# Altium schematic sheet [04] - CAN.SchDoc
size A3
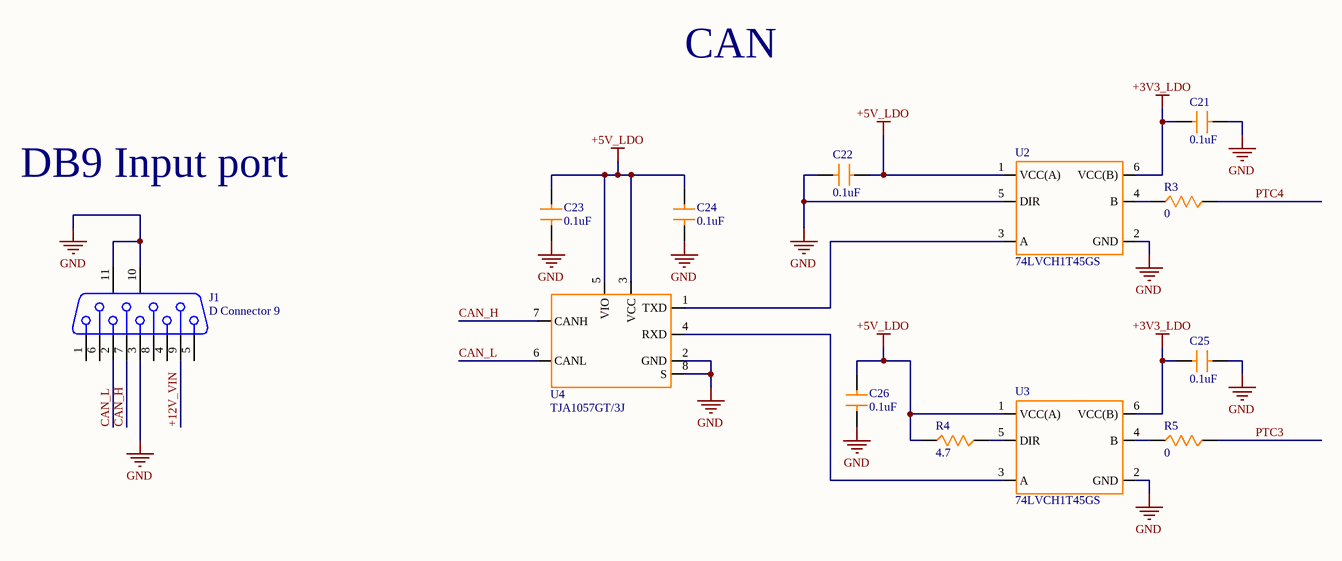
[diagram p0: [04] - CAN.SchDoc]

## Parts
C21  0.1uF  [C0805]
C22  0.1uF  [C0805]
C23  0.1uF  [C0805]
C24  0.1uF  [C0805]
C25  0.1uF  [C0805]
C26  0.1uF  [C0805]
J1  D Connector 9  [DSUB1.385-2H9]
R3  0  [R0805]
R4  4.7  [R0805]
R5  0  [R0805]
U2  74LVCH1T45GS  [74LVCH1T45GS,132]
U3  74LVCH1T45GS  [74LVCH1T45GS,132]
U4  TJA1057GT/3J  [TJA1057GT/3J]

## Nets
+3V3_LDO: C21.2 C25.2 U2.6(VCC(B)) U3.6(VCC(B))
+5V_LDO: C22.2 C23.2 C24.2 C26.2 R4.1 U2.1(VCC(A)) U3.1(VCC(A)) U4.3(VCC) U4.5(VIO)
GND: C21.1 C22.1 C23.1 C24.1 C25.1 C26.1 J1.3 J1.10(MH1) J1.11(MH2) U2.2(GND) U2.5(DIR) U3.2(GND) U4.2(GND) U4.8(S)
+12V_VIN: J1.9
CAN_H: J1.7 U4.7(CANH)
CAN_L: J1.2 U4.6(CANL)
PTC3: R5.2
PTC4: R3.2
NetR3_1: R3.1 U2.4(B)
NetR4_2: R4.2 U3.5(DIR)
NetR5_1: R5.1 U3.4(B)
NetU2_3: U2.3(A) U4.1(TXD)
NetU3_3: U3.3(A) U4.4(RXD)

Not connected (* = marked no-connect by the designer): J1 1 4 5 6 8

## Notes on the sheet
- CAN
- DB9 Input port

## Library data of the parts
C21-C26 = C_0805-0.1uF: Multilayer Ceramic Capacitors MLCC - SMD/SMT 0.1uF 10% 50V AEC-Q200; Manufacturer: Yageo; Manufacturer Part Number: AS0805KKX7R9BB104; Voltage Rating DC: 50 VDC; Capacitance - nF: 100 nF; Capacitance - pF: 100000 pF; CNHTS: 8532241000; Dielectric: X7R; TARIC: 8532240000; Product Status: New Product; Supplier 1: Mouser; RoHS: RoHS Compliant; Category: Multilayer Ceramic Capacitors MLCC - SMD/SMT; Stock 1: 30283; Pricing 1: 1=0.670, 10=0.461, 100=0.262, 500=0.238, 1000=0.165, 3000=0.156, 6000=0.146, 9000=0.136, 24000=0.122 (USD); Capacitance: 0.1 uF; Height: 1.25 mm; Length: 2 mm; Package / Case: 0805 (2012 metric); Packaging: Cut Tape; Product: Automotive MLCCs; Series: AS; Termination Style: SMD/SMT; Tolerance: 10 %; Width: 1.25 mm; Brand: Yageo; Case Code - in: 0805; Case Code - mm: 2212; HTS Code: 8532240020; Maximum Operating Temperature: + 125 C; Minimum Operating Temperature: - 55 C; Product Type: Ceramic Capacitors; Standard Pack Qty: 3000; Subcategory: Capacitors; Termination: Flexible (Soft); RoHS - Mouser: Y; Minimum Order Quantity: 1; Reeling: True; ComponentLink1URL: http://www.mouser.com/datasheet/2/447/yageodocoutput-1313910.pdf; ComponentLink1Description: http://www.mouser.com/datasheet/2/447/yageodocoutput-1313910.pdf; Supplier Part Number 1: 603-AS0805KKX79BB104
J1 = D Connector 9: Receptacle Assembly, 9 Position, Right Angle; PackageDocument: O; Positions: 9; Published: 15-Jun-2001; LatestRevisionDate: 17-Jul-2002; LatestRevisionNote: Re-released for DXP Platform.; DatasheetDocument: 1-Sep-1999; PackageReference: 788750; Publisher: Altium Limited; Orientation: Right Angle; Gender: Receptacle
R3 R5 = R_0805-0: Current Sense Resistors - SMD 0 ohm Jumper 1/2W; Manufacturer: Yageo; Manufacturer Part Number: PA0805-R-470RL; Power Rating: 500 mW (1/2 W); Resistance: 0 Ohms; CNHTS: 8533211000; TARIC: 8533210000; Product Status: New Product; Supplier 1: Mouser; RoHS: RoHS Compliant; Category: Current Sense Resistors - SMD; Stock 1: 3927; Pricing 1: 1=1.30, 10=1.06, 100=0.706, 500=0.595, 1000=0.495, 5000=0.431, 10000=0.421, 25000=0.409 (USD); Application: Current Sense; Length: 2.03 mm; Packaging: Cut Tape; Product: Current Sense Chip Resistor Surface Mount; Series: PA_L; Technology: Metal Element; Termination Style: SMD/SMT; Tolerance: -; Type: Low TCR Current Sense Resistor; Width: 1.27 mm; Brand: Yageo; Mounting Style: PCB Mount; Case Code - in: 0805; Case Code - mm: 2012; HTS Code: 8533210030; Maximum Operating Temperature: + 155 C; Minimum Operating Temperature: - 55 C; Product Type: Current Sense Resistors; Standard Pack Qty: 5000; Subcategory: Resistors; Termination: 2 Terminal; RoHS - Mouser: Y; Minimum Order Quantity: 1; Reeling: True; ComponentLink1URL: http://www.mouser.com/datasheet/2/447/PYu-PA0805_L_51_RoHS_0-1480254.pdf; ComponentLink1Description: http://www.mouser.com/datasheet/2/447/PYu-PA0805_L_51_RoHS_0-1480254.pdf; Supplier Part Number 1: 603-PA0805-R-470RL
R4 = R_0805-4.7: Thin Film Resistors - SMD 4.7 ohm 1% 50 ppm High-Precision; Manufacturer: Yageo; Manufacturer Part Number: RT0805FRE074R7L; Power Rating: 125 mW (1/8 W); Resistance: 4.7 Ohms; Temperature Coefficient: 50 PPM / C; Voltage Rating: 150 V; Product Status: New Product; Supplier 1: Mouser; RoHS: RoHS Compliant; Category: Thin Film Resistors - SMD; Stock 1: 0; Pricing 1: 1=0.180, 10=0.112, 100=0.037, 1000=0.026, 5000=0.019, 10000=0.018, 25000=0.017 (USD); Features: -; Height: 0.5 mm; Length: 2 mm; Package / Case: 0805 (2012 metric); Packaging: Cut Tape; Product: Precision Resistors Thin Film SMD; Series: RT; Termination Style: SMD/SMT; Tolerance: 1 %; Width: 1.25 mm; Brand: Yageo; Case Code - in: 0805; Case Code - mm: 2012; Maximum Operating Temperature: + 155 C; Minimum Operating Temperature: - 55 C; Standard Pack Qty: 5000; RoHS - Mouser: Y; Minimum Order Quantity: 1; Reeling: True; ComponentLink1URL: https://www.mouser.com/datasheet/2/447/PYu-RT_1-to-0.01_RoHS_L_9-1222720.pdf; ComponentLink1Description: https://www.mouser.com/datasheet/2/447/PYu-RT_1-to-0.01_RoHS_L_9-1222720.pdf; Supplier Part Number 1: 603-RT0805FRE074R7L
U2 U3 = 74LVCH1T45GS,132: Bus Transceivers 3.6V 250mW 8.2ns; Manufacturer: Nexperia; Supply Voltage - Max: 5.5 V; Supply Voltage - Min: 1.2 V; Supplier 1: Mouser; Manufacturer Part Number: 74LVCH1T45GS,132; RoHS: RoHS Compliant; Category: Bus Transceivers; Stock 1: 7431; Pricing 1: 1=0.590, 10=0.487, 100=0.314, 1000=0.252, 5000=0.212, 10000=0.204, 25000=0.197, 50000=0.193 (USD); Package / Case: XSON-6; Packaging: Cut Tape; Brand: Nexperia; Mounting Style: SMD/SMT; Maximum Operating Temperature: + 125 C; Pd - Power Dissipation: 250 mW; Product Type: Bus Transceivers; Propagation Delay Time: 8.2 ns; Standard Pack Qty: 5000; Subcategory: Logic ICs; RoHS - Mouser: Y; Minimum Order Quantity: 1; Reeling: True; ComponentLink1URL: https://www.mouser.com/datasheet/2/916/74LVC_LVCH1T45-1319147.pdf; ComponentLink1Description: https://www.mouser.com/datasheet/2/916/74LVC_LVCH1T45-1319147.pdf; Supplier Part Number 1: 771-74LVCH1T45GS132
U4 = TJA1057GT/3J: CAN Interface IC High-speed CAN transceiver; Manufacturer: NXP Semiconductors; Data Rate: 5 Mb/s; Number of Drivers: 1 Driver; Number of Receivers: 1 Receiver; Operating Supply Current: 80 mA; Operating Supply Voltage: 4.75 V to 5.25 V; Propagation Delay Time: 210 ns; Supply Voltage - Max: 5.25 V; Supply Voltage - Min: 4.75 V; Supplier 1: Mouser; Manufacturer Part Number: TJA1057GT/3J; RoHS: RoHS Compliant; Category: CAN Interface IC; Stock 1: 18764; Pricing 1: 1=0.910, 10=0.771, 100=0.592, 500=0.523, 1000=0.413, 2500=0.367, 10000=0.353, 25000=0.342 (USD); Package / Case: SO-8; Packaging: Cut Tape; Product: CAN Transceivers; Series: TJA1057; Type: High Speed; Brand: NXP Semiconductors; Mounting Style: SMD/SMT; Maximum Operating Temperature: + 150 C; Minimum Operating Temperature: - 40 C; Product Type: CAN Interface IC; Standard Pack Qty: 2500; Subcategory: Interface ICs; RoHS - Mouser: Y; Minimum Order Quantity: 1; Reeling: True; ComponentLink1URL: https://www.mouser.com/datasheet/2/302/TJA1057-1127934.pdf; ComponentLink1Description: https://www.mouser.com/datasheet/2/302/TJA1057-1127934.pdf; Supplier Part Number 1: 771-TJA1057GT/3J